# EAGLE schematic display_spi7 (EAGLE 7.7.0)
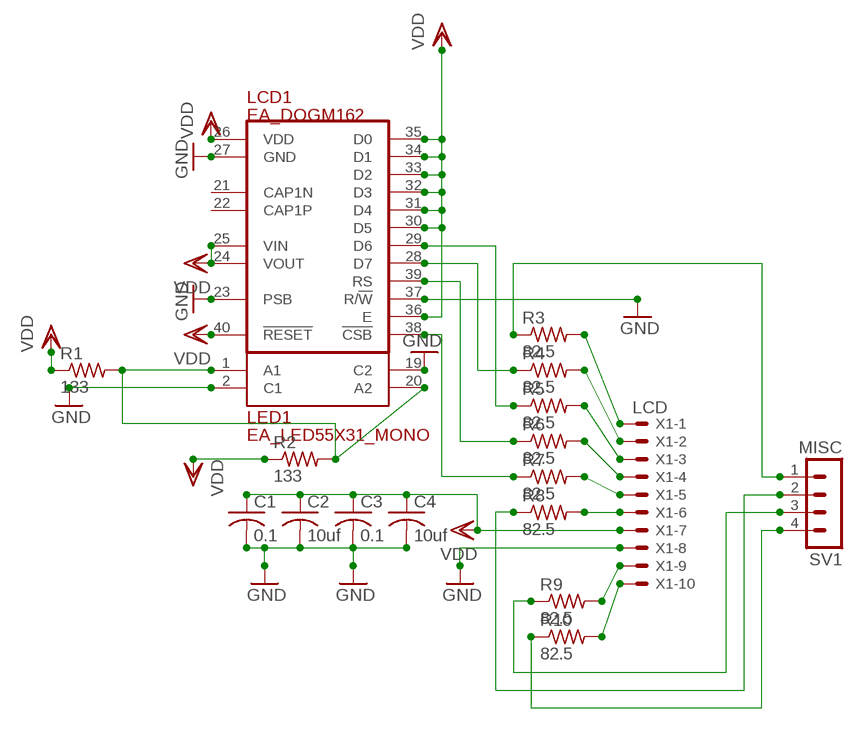
[diagram p0: schematic, sheet 1]

## Parts
C1  0.1  C-USC1206  [C1206]
C2  10uf  C-USC1206  [C1206]
C3  0.1  C-USC1206  [C1206]
C4  10uf  C-USC1206  [C1206]
LCD1  EA_DOGM162  [EA_DOGM]
LED1  EA_LED55X31_MONO  [EA_LED55X31]
R1  133  R-US_R1206  [R1206]
R2  133  R-US_R1206  [R1206]
R3  82.5  R-US_R1206  [R1206]
R4  82.5  R-US_R1206  [R1206]
R5  82.5  R-US_R1206  [R1206]
R6  82.5  R-US_R1206  [R1206]
R7  82.5  R-US_R1206  [R1206]
R8  82.5  R-US_R1206  [R1206]
R9  82.5  R-US_R1206  [R1206]
R10  82.5  R-US_R1206  [R1206]
SV1  MISC  MA04-1  [MA04-1]
X1  LCD  22-23-2101  [22-23-2101]

## Nets
GND: C1.2 C2.2 C3.2 C4.2 LCD1.23(PSB) LCD1.27(GND) LCD1.37(R/!W!) LED1.2(C1) LED1.19(C2) X1.8
N$1: R3.2 X1.1
N$2: R4.2 X1.2
N$3: R5.2 X1.3
N$4: R6.2 X1.4
N$5: R7.2 X1.5
N$6: R8.2 X1.6
N$7: R9.2 X1.9
N$8: R10.2 X1.10
N$9: LCD1.28(D7) R4.1
N$10: LCD1.29(D6) R5.1
N$11: LCD1.39(RS) R6.1
N$12: LCD1.38(!CSB!) R7.1
N$13: R3.1 SV1.1
N$14: R8.1 SV1.2
N$15: R9.1 SV1.3
N$16: R10.1 SV1.4
N$18: LED1.1(A1) LED1.20(A2) R1.2 R2.2
VDD: C1.1 C2.1 C3.1 C4.1 LCD1.24(VOUT) LCD1.25(VIN) LCD1.26(VDD) LCD1.30(D5) LCD1.31(D4) LCD1.32(D3) LCD1.33(D2) LCD1.34(D1) LCD1.35(D0) LCD1.36(E) LCD1.40(!RESET!) R1.1 R2.1 X1.7
Unconnected: LCD1.21(CAP1N) LCD1.22(CAP1P)

## Library data of the parts
C1-C4 = rcl:C-US: CAPACITOR, American symbol; SPICEPREFIX: C
LCD1 = ea_v66:EA_DOGM162: ELECTRONIC ASSEMBYL GmbH EA DOGM162-A EA DOGM081-A EA DOGM163-A
LED1 = ea_v66:EA_LED55X31_MONO
R1-R10 = rcl:R-US_: RESISTOR, American symbol; SPICEPREFIX: R
SV1 = con-lstb:MA04-1: PIN HEADER; OC_FARNELL: unknown; OC_NEWARK: unknown
X1 = con-molex:22-23-2101: .100" (2.54mm) Center Header - 10 Pin; MF: MOLEX; MPN: 22-23-2101; OC_FARNELL: 1756828; OC_NEWARK: 94C0765